# Altium project MTB Telemetry System.PrjPcb
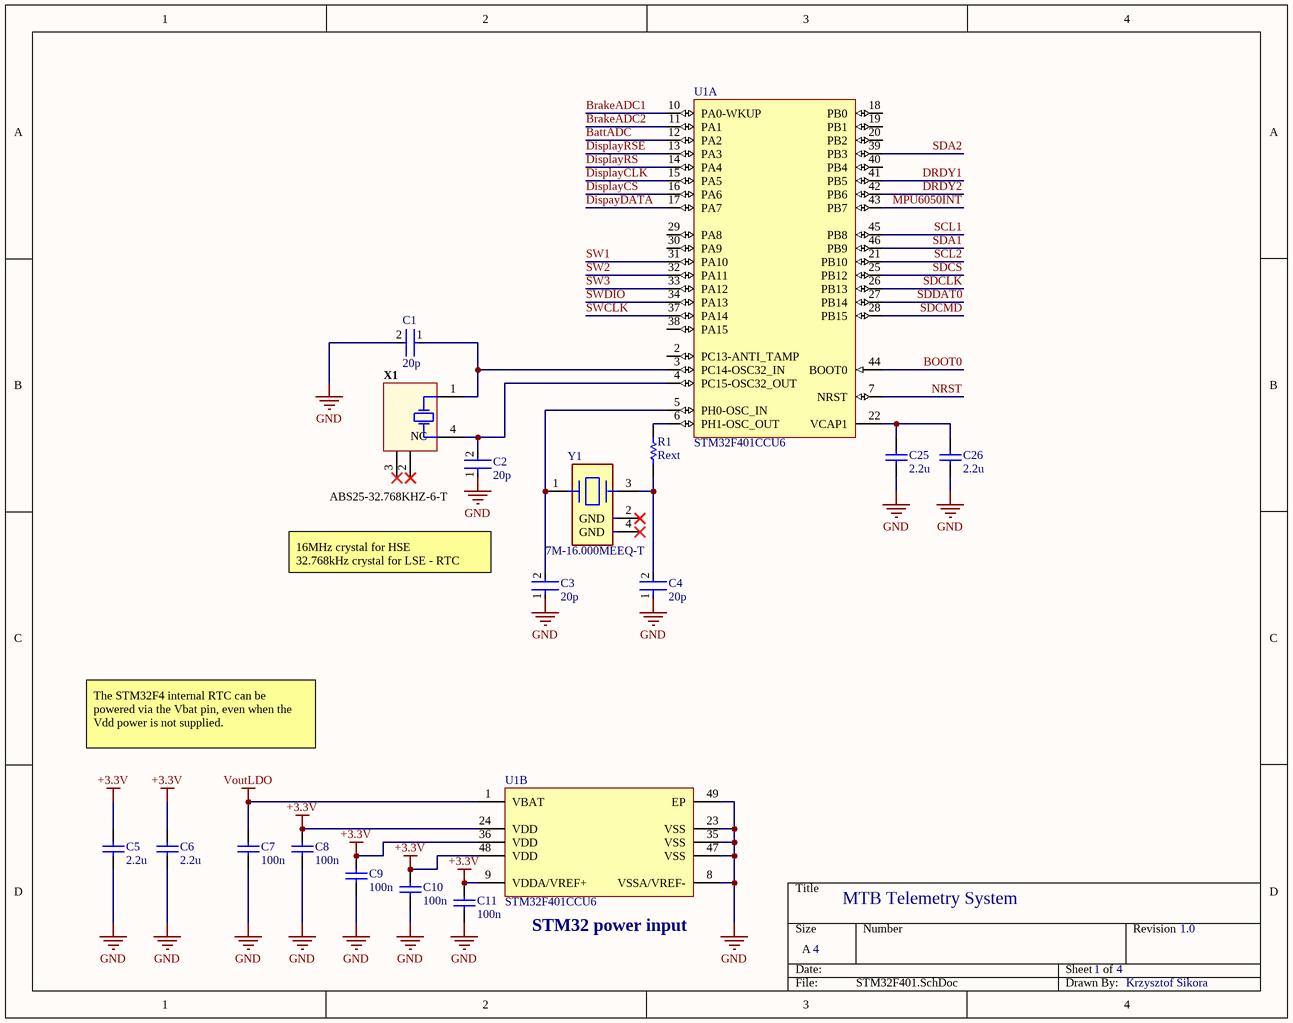
[diagram p0: STM32F401.SchDoc]
4 sheets, 66 parts. Net scope: global (net labels, ports and power ports of the same name join across sheets).
Board file: MTB_Telemetry_System_PCB.PcbDoc
Sheets:
  STM32F401.SchDoc
  Power supply.SchDoc
  Sensors.SchDoc
  Peripherals.SchDoc

## Sheet STM32F401.SchDoc
size A; SheetNumber: 1; SheetTotal: 4

### Parts
C1  20p  [FP-C0603C-CF-MFG]
C2  20p  [FP-C0603C-CF-MFG]
C3  20p  [FP-C0603C-CF-MFG]
C4  20p  [FP-C0603C-CF-MFG]
C5  2.2u  [CAPC2013X88X50LL20T25]
C6  2.2u  [CAPC2013X88X50LL20T25]
C7  100n  [CAPC2013X88X50LL20T25]
C8  100n  [CAPC2013X88X50LL20T25]
C9  100n  [CAPC2013X88X50LL20T25]
C10  100n  [CAPC2013X88X50LL20T25]
C11  100n  [CAPC2013X88X50LL20T25]
C25  2.2u  [CAPC2013X88X50LL20T25]
C26  2.2u  [CAPC2013X88X50LL20T25]
R1  Rext  [RESC1609X50X30NL8T20]
U1  STM32F401CCU6  [STM-UFQFPN48_N]  (parts A,B of 2)
X1  ABS25-32.768KHZ-6-T  [ABRA-ABS25-4_V]
Y1  7M-16.000MEEQ-T  [FP-7M-MFG]

### Nets
+3.3V: C5.2 C6.2 C8.2 C9.2 C10.2 C11.2 U1.9(VDDA/VREF+) U1.24(VDD) U1.36(VDD) U1.48(VDD)
GND: C1.2 C2.1 C3.1 C4.1 C5.1 C6.1 C7.1 C8.1 C9.1 C10.1 C11.1 C25.1 C26.1 U1.8(VSSA/VREF-) U1.23(VSS) U1.35(VSS) U1.47(VSS) U1.49(EP)
VoutLDO: C7.2 U1.1(VBAT)
BattADC: U1.12(PA2)
BOOT0: U1.44(BOOT0)
BrakeADC1: U1.10(PA0-WKUP)
BrakeADC2: U1.11(PA1)
DispayDATA: U1.17(PA7)
DisplayCLK: U1.15(PA5)
DisplayCS: U1.16(PA6)
DisplayRS: U1.14(PA4)
DisplayRSE: U1.13(PA3)
DRDY1: U1.41(PB5)
DRDY2: U1.42(PB6)
MPU6050INT: U1.43(PB7)
NRST: U1.7(NRST)
SCL1: U1.45(PB8)
SCL2: U1.21(PB10)
SDA1: U1.46(PB9)
SDA2: U1.39(PB3)
SDCLK: U1.26(PB13)
SDCMD: U1.28(PB15)
SDCS: U1.25(PB12)
SDDAT0: U1.27(PB14)
SW1: U1.31(PA10)
SW2: U1.32(PA11)
SW3: U1.33(PA12)
SWCLK: U1.37(PA14)
SWDIO: U1.34(PA13)
NetC1_1: C1.1 U1.3(PC14-OSC32_IN) X1.1(X1)
NetC2_2: C2.2 U1.4(PC15-OSC32_OUT) X1.4(X2)
NetC3_2: C3.2 U1.5(PH0-OSC_IN) Y1.1
NetC4_2: C4.2 R1.1 Y1.3
NetC25_2: C25.2 C26.2 U1.22(VCAP1)
NetR1_2: R1.2 U1.6(PH1-OSC_OUT)

Not connected (* = marked no-connect by the designer): U1 2(PC13-ANTI_TAMP) 18(PB0) 19(PB1) 20(PB2) 29(PA8) 30(PA9) 38(PA15) 40(PB4); X1 2(NC)* 3(NC)*; Y1 2(GND)* 4(GND)*

### Notes on the sheet
- 16MHz crystal for HSE
  32.768kHz crystal for LSE - RTC
- The STM32F4 internal RTC can be powered via the Vbat pin, even when the Vdd power is not supplied.
- MTB Telemetry System
- (near U1) STM32 power input
- 4
- 1
- 1.0
- Krzysztof Sikora

### Library data of the parts
C1-C4 = CMP-2006-03061-2: CAP CER 0.1UF 50V X7R 0603; Manufacturer: KEMET; Manufacturer Part Number: C0603C104K5RACTU; Tolerance: 0.1; Temperature Coefficient: 30ppm/°C; Material: Ceramic; Automotive Grade: Grade 1; Value: 0.10 μF; Temperature: -55°C to +125°C; RoHS: TRUE; Temperature Range High: +125°C; Lead Free: Yes; Octopart: https://octopart.com/c0603c104k5ractu-kemet-139244; Digikey Description: CAP CER 0.1UF 50V X7R 0603; Category: Cap; Package: C0603C-CF; ComponentLink2Description: Datasheet; Temperature Range Low: -55°C; Device Class L1: Passive Components; Voltage Rating: 50 V; Automotive: Yes; Device Class L3: Ceramic Capacitors; ComponentLink2URL: https://api.kemet.com/component-edge/download/datasheet/C0603C100J5GACAUTO.pdf; Capacitance: 0.10 μF; Device Class L2: Capacitors; Temperature Characteristic: X7R; Height: 0.87mm
C5-C11 C25 C26 = CMP-2007-00266-1: Manufacturer: Kemet; Part Number: C0805C103K5RACTU
R1 = CMP-1666-00005-4: Chip Resistor, 10 KOhm, +/- 1%, 100 mW, -55 to 155 degC, 0603 (1608 Metric), RoHS, Tape and Reel; Manufacturer: Vishay Semiconductor; Voltage Rating: 75 V; Max Operating Temperature: 155 degC; PackageDescription: 2-Pin Surface Mount Device, Body 1.575 x 0.85 mm; ComponentLink1Description: Manufacturer URL; RoHSCompliant: true; PackageReference: 0603; REACH SVHC: Unknown; Length: 1.55 mm; DatasheetVersion: 06/2012; Packaging: Tape and Reel; Min Operating Temperature: -55 degC; Mounting Technology: Surface Mount; ComponentLink2URL: https://datasheet.ciiva.com/11809/0900766b80d98afc-11809037.pdf; Height: 0.45 mm; ComponentLink2Description: Datasheet; Package Quantity: 5000; ComponentLink1URL: http://www.vishay.com/
U1 = CMP-0243-00119-2: ARM Cortex-M4 32-bit MCU+FPU, 105 DMIPS, 256 kB Flash, 64 kB Internal RAM, 36 I/Os, 48-pin UFQFPN, -40 to 85 degC, Tray; Manufacturer: STMicroelectronics; Supply Voltage(Vcc) max (V): 3.6; I/Os (High Current): 36; Internal RAM Size (kB): 64; Operating Frequency(F) (Processor speed) (MHz): 84; FLASH Size (Prog) (kB): 256; Supply Voltage(Vcc) min (V): 1.8; Packing: Tray; PackageReference: UFQFPN48; PackageVersion: Rev. 1, 04/2013; Core: ARM Cortex-M4; ComponentLink1Description: Manufacturer URL; ComponentLink3Description: Package Specification; PackageDescription: 48-Pin Ultra Thin Fine Pitch Quad Flat No-Lead, 7 x 7 x 0.6 mm Body, 0.5 mm Pitch, Exposed Pad; Mounting Technology: Surface Mount; ComponentLink2URL: http://www.st.com/st-web-ui/static/active/en/resource/technical/document/data_brief/DM00071938.pdf; DatasheetVersion: Rev. 1; ComponentLink2Description: Datasheet; ComponentLink1URL: http://www.st.com/web/en/home.html; PartNumber: STM32F401CCU6; ComponentLink3URL: http://www.st.com/st-web-ui/static/active/en/resource/technical/document/data_brief/DM00071938.pdf
X1 = CMP-2000-05036-1: Low Frequency Crystal, 32.768 KHz, 6 pF, +/- 20 ppm, -40 to 85 degC, 4-Pin SMD, RoHS, Tape and Reel; Manufacturer: Abracon; Tolerance: 20PPM; ESR: 50kOhms; Case Width: 3.8mm; Case Height: 2.5mm; Case Length: 8mm; Load Capacitance: 6pF; Operating Temperature Range: -40Cto+85C; Package Reference: ABS25; Factory Pack Quantity: 3000; Package Description: 4-Pin Surface Mount Device, Body 8 x 3.8 mm, Pitch 5.5 mm; Frequency: 32.768kHz; Termination Style: SMD/SMT; Manufacturer URL: http://www.abracon.com/; Type: LowFrequencyCrystal; Dimensions: 3.8mmWx8mmLx2.5mmH; Product Category: Crystals; Series: ABS25; RoHS: Details; Package / Case: 8mmx3.8mm; Datasheet Version: Jun-17; Brand: ABRACON; Datasheet URL: https://datasheet.ciiva.com/854/abs25-854528.pdf; Packaging: Reel; Mounting Style: SMD/SMT
Y1 = CMP-18717-000438-1: Crystal 16MHz, 10ppm, 10pF, 60Ω; ESR (Equivalent Series Resistance): 100R; Width: 2.5mm; REACH SVHC: No SVHC; Mount: Surface Mount; Package Quantity: 1; Depth: 2.5mm; Frequency Tolerance: 10ppm; Length: 3.2mm; Packaging: Tape and Reel; Termination: SMD/SMT; RoHS Compliant: Yes; Max Operating Temperature: 70°C; Min Operating Temperature: -10°C; Tolerance: 10ppm; Frequency Stability: 10ppm; Series: 7M; Height: 0.031inch; Number of Pins: 4; Load Capacitance: 10pF; Frequency: 16MHz; Case/Package: SMD/SMT

## Sheet Power supply.SchDoc
size A; SheetNumber: 2; SheetTotal: 4
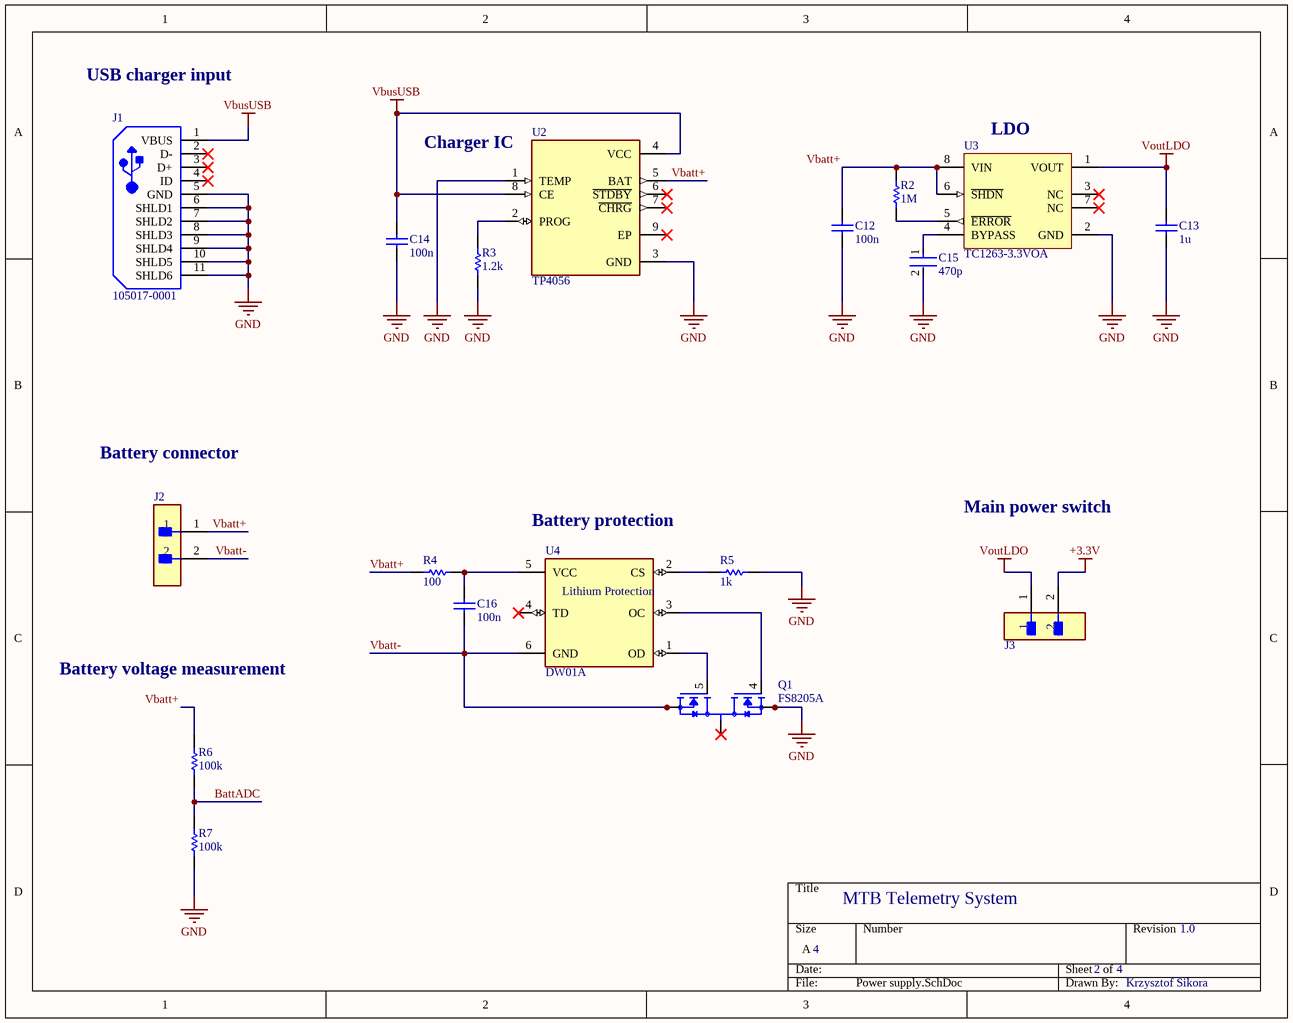
[diagram p1: Power supply.SchDoc]

### Parts
C12  100n  [CAPC2013X88X50LL20T25]
C13  1u  [CAPC2013X88X50LL20T25]
C14  100n  [CAPC2013X88X50LL20T25]
C15  470p  [FP-C0603C-CF-MFG]
C16  100n  [CAPC2013X88X50LL20T25]
J1  105017-0001  [USB-MICRO-B_V]
J2  B2B-XH-A(LF)(SN)  [FP-B2B-XH-A_LF_SN-MFG]  (value not drawn)
J3  B2B-XH-A(LF)(SN)  [FP-B2B-XH-A_LF_SN-MFG]  (value not drawn)
Q1  FS8205A  [SOP65P640X120-8N]
R2  1M  [RESC2013X60X35ML10T20]
R3  1.2k  [RESC2013X60X35ML10T20]
R4  100  [RESC2013X60X35ML10T20]
R5  1k  [RESC2013X60X35ML10T20]
R6  100k  [RESC2013X60X35ML10T20]
R7  100k  [RESC2013X60X35ML10T20]
U2  TP4056  [SOP127P600X175-9N]
U3  TC1263-3.3VOA  [SOIC-OA8_M]
U4  DW01A  [SOT23-6]

### Nets
+3.3V: J3.2
GND: C12.1 C13.1 C14.1 C15.2 J1.5(GND) J1.6(SHLD1) J1.7(SHLD2) J1.8(SHLD3) J1.9(SHLD4) J1.10(SHLD5) J1.11(SHLD6) Q1.2(S1) Q1.3(S1) R3.1 R5.1 R7.2 U2.1(TEMP) U2.3(GND) U3.2(GND)
VbusUSB: C14.2 J1.1(VBUS) U2.4(VCC) U2.8(CE)
VoutLDO: C13.2 J3.1 U3.1(VOUT)
BattADC: R6.2 R7.1
Vbatt+: C12.2 J2.1 R2.2 R4.2 R6.1 U2.5(BAT) U3.6(~{SHDN}) U3.8(VIN)
Vbatt-: C16.1 J2.2 Q1.6(S2) Q1.7(S2) U4.6(GND)
NetC15_1: C15.1 U3.4(BYPASS)
NetC16_2: C16.2 R4.1 U4.5(VCC)
NetQ1_1: Q1.1(D12) Q1.8(D12)
NetQ1_4: Q1.4(G1) U4.3(OC)
NetQ1_5: Q1.5(G2) U4.1(OD)
NetR2_1: R2.1 U3.5(~{ERROR})
NetR3_2: R3.2 U2.2(PROG)
NetR5_2: R5.2 U4.2(CS)

Not connected (* = marked no-connect by the designer): J1 2(D-)* 3(D+)* 4(ID)*; U2 6(~{STDBY})* 7(~{CHRG})* 9(EP)*; U3 3(NC)* 7(NC)*; U4 4(TD)*

### Notes on the sheet
- USB charger input
- (near U2) Charger IC
- (near U3) LDO
- Battery connector
- Battery protection
- Main power switch
- Battery voltage measurement
- MTB Telemetry System
- 4
- 2
- 1.0
- Krzysztof Sikora
- (in symbol DW01A) Lithium Protection

### Library data of the parts
C12-C14 C16 = CMP-2007-00266-1: as C5 on sheet STM32F401
C15 = CMP-2006-03061-2: as C1 on sheet STM32F401; Temperature: -55°C to +125°C; RoHS: TRUE; Temperature Range High: +125°C; Lead Free: Yes; Octopart: https://octopart.com/c0603c104k5ractu-kemet-139244; Digikey Description: CAP CER 0.1UF 50V X7R 0603; Category: Cap; Package: C0603C-CF; ComponentLink2Description: Datasheet; Temperature Range Low: -55°C; Device Class L1: Passive Components; Voltage Rating: 50 V; Automotive: Yes; Device Class L3: Ceramic Capacitors; ComponentLink2URL: https://api.kemet.com/component-edge/download/datasheet/C0603C100J5GACAUTO.pdf; Capacitance: 0.10 μF; Device Class L2: Capacitors; Temperature Characteristic: X7R; Height: 0.87mm
J1 = CMP-2000-05827-1: Micro-USB B Receptacle, Right Angle, Bottom Mount, Surface Mount, with Solder Tabs, -30 to 85 degC, 5-Pin USB, RoHS, Tape and Reel; Manufacturer: Molex; Featured Product: Micro-USBConnectorsUSBConnectors; Other Names: WM1399DKR; Package Version: Rev. F, 12/2012; Number of Contacts: 5; Connector Type: USB-microB; Catalog Drawings: 1050170001; 3D Model: 105017-0001.stp; Mating Products: WM17145-ND-CABLEMICROUSBBTOSTDA1.0MWM17147-ND-CABLEMICROUSBBTOSTDA2.0MWM17146-ND-CABLEMICROUSBBTOSTDA1.5M; PCN Assembly/Origin: ResinSupplier21/Oct/2015; Voltage - Max: 30V; Online Catalog: Molex-MicroUSB; Manufacturer URL: http://www.molex.com/; Package Description: 5-Leads USB, Micro B, Body 7.5 x 5 mm, Pitch 0.65 mm; Datasheet URL: http://www.molex.com/elqNow/elqRedir.htm?ref=http://www.molex.com/webdocs/datasheets/pdf/en-us/1050170001_IO_CONNECTORS.pdf; Ingress Protection: -; Datasheet Version: 03/2016; Mounting Type: BoardCutout,SurfaceMount,RightAngle; Circuits: 5; Standard Package: 1; Package Reference: MICRO-B; Package URL: http://www.molex.com/pdm_docs/sd/1050170001_sd.pdf; Category: Connectors,Interconnects; Series: -; RoHS Information: 1050170001CertofCompliance; Features: Shielded,SolderRetention; Family: USB,DVI,HDMIConnectors; Specifications: -; Gender: Receptacle; Packaging: Digi-Reel®; Mounting Technology: SurfaceMount
J2 J3 = CMP-2000-05888-3: CONN HEADER VERT 2POS 2.5MM; Current Rating: 3A; Voltage Rating: 250V; Number of Contacts: 2; Contact Resistance: 20mR; Wire/Cable Gauge: 22AWG; Insulation Resistance: 1GR; Connector Type: Male Pin; Packaging: Bulk; Contact Material: Brass; Lead Free: Lead Free; Orientation: Straight; Contact Plating: Tin; Max Current Rating: 3A; Termination: Solder; Fastening Type: Detent; Depth: 5.75mm; Housing Material: Polyamide; REACH SVHC: No SVHC; Series: XH; Voltage Rating (AC): 250V; Number of Positions: 2; Color: Natural; Contact Type: Male Pin; Max Voltage Rating (DC): 250V; Pitch: 2.5mm; Lead Pitch: 2.5mm; Mount: Through Hole; Max Operating Temperature: 85°C; Length: 7.4mm; Max Voltage Rating (AC): 250V; Min Operating Temperature: -25°C; Number of Rows: 1; Housing Color: White
Q1 = FS8205A: N/A; MF: Fortune Semiconductor; MP: FS8205A; Value: *; Availability: Not in stock; Package: Package; Price: None; SnapEDA_Link: https://www.snapeda.com/parts/FS8205A/Fortune+Semiconductor/view-part/?ref=snap; Check_prices: https://www.snapeda.com/parts/FS8205A/Fortune+Semiconductor/view-part/?ref=eda
R2-R7 = CMP-2100-03673-1: Chip Resistor, 0 Ohm, Jumper, +/- 5%, 0.125 W, -55 to 155 degC, 0805 (2012 Metric), RoHS, Tape and Reel; Manufacturer: Yageo; Power Rating: 125mW; Resistance: 0mOhm; Voltage Rating (DC): 150V; Temperature Coefficient: 200ppm/degreesC; Height: 0.5mm; Depth: 1.25mm; Case Code (Imperial): 0805; Lead Free: LeadFree; Military Standard: Not; Package Description: 2-Pin Surface Mounted Device, Body 2 x 1.25 mm; Case Code (Metric): 2012; Composition: ThickFilm; Voltage Rating: 150V; Manufacturer URL: http://www.yageo.com/; Packaging: TapeandReel; Package Reference: 0805; REACH SVHC: Unknown; Tolerance: 5%; Case/Package: 0805; Max Operating Temperature: 155degC; Number of Pins: 2; Min Operating Temperature: -55degC; RoHSCompliant: true; Length: 2mm; Datasheet URL: http://www.yageo.com/NewPortal/yageodocoutput?fileName=/pdf/R-Chip/PYu-RC_Group_51_RoHS_L_5.pdf; Termination: SMD/SMT; Radiation Hardening: No; Width: 1.25mm; Contact Plating: Tin; Datasheet Version: Rev. 5, 10/2016
U2 = TP4056: Complete single cell Li-Ion battery with a constant current / constant voltage linear charger; MF: NanJing Top Power ASIC Corp.; Check_prices: https://www.snapeda.com/parts/TP4056/NanJing+Top+Power+ASIC+Corp./view-part/?ref=eda; SnapEDA_Link: https://www.snapeda.com/parts/TP4056/NanJing+Top+Power+ASIC+Corp./view-part/?ref=snap; Price: None; Availability: Not in stock; Package: Package; MP: TP4056; Value: *
U3 = CMP-0136-00199-1: 500mA Fixed Output, CMOS LDO with Shutdown, 8-Pin SOIC 150mil, Extended Temperature; PackageDescription: 8-Lead Plastic Small Outline (OA) - Narrow, 3.90mm Body [SOIC]; PackageVersion: revBB, Aug-2009; DatasheetVersion: revC, Jan-2005; PackageReference: SOIC-OA8; Code_IPC: SOIC127P600-8
U4 = DW01A: One Cell Lithium-ion/Polymer Battery Protection IC; MF: Fortune Semiconductor; SnapEDA_Link: https://www.snapeda.com/parts/DW01A/Fortune+Semiconductor/view-part/?ref=snap; Package: SOT-23-6 Fortune Semiconductor; Value: *; MP: DW01A; Check_prices: https://www.snapeda.com/parts/DW01A/Fortune+Semiconductor/view-part/?ref=eda

## Sheet Sensors.SchDoc
size A; SheetNumber: 3; SheetTotal: 4
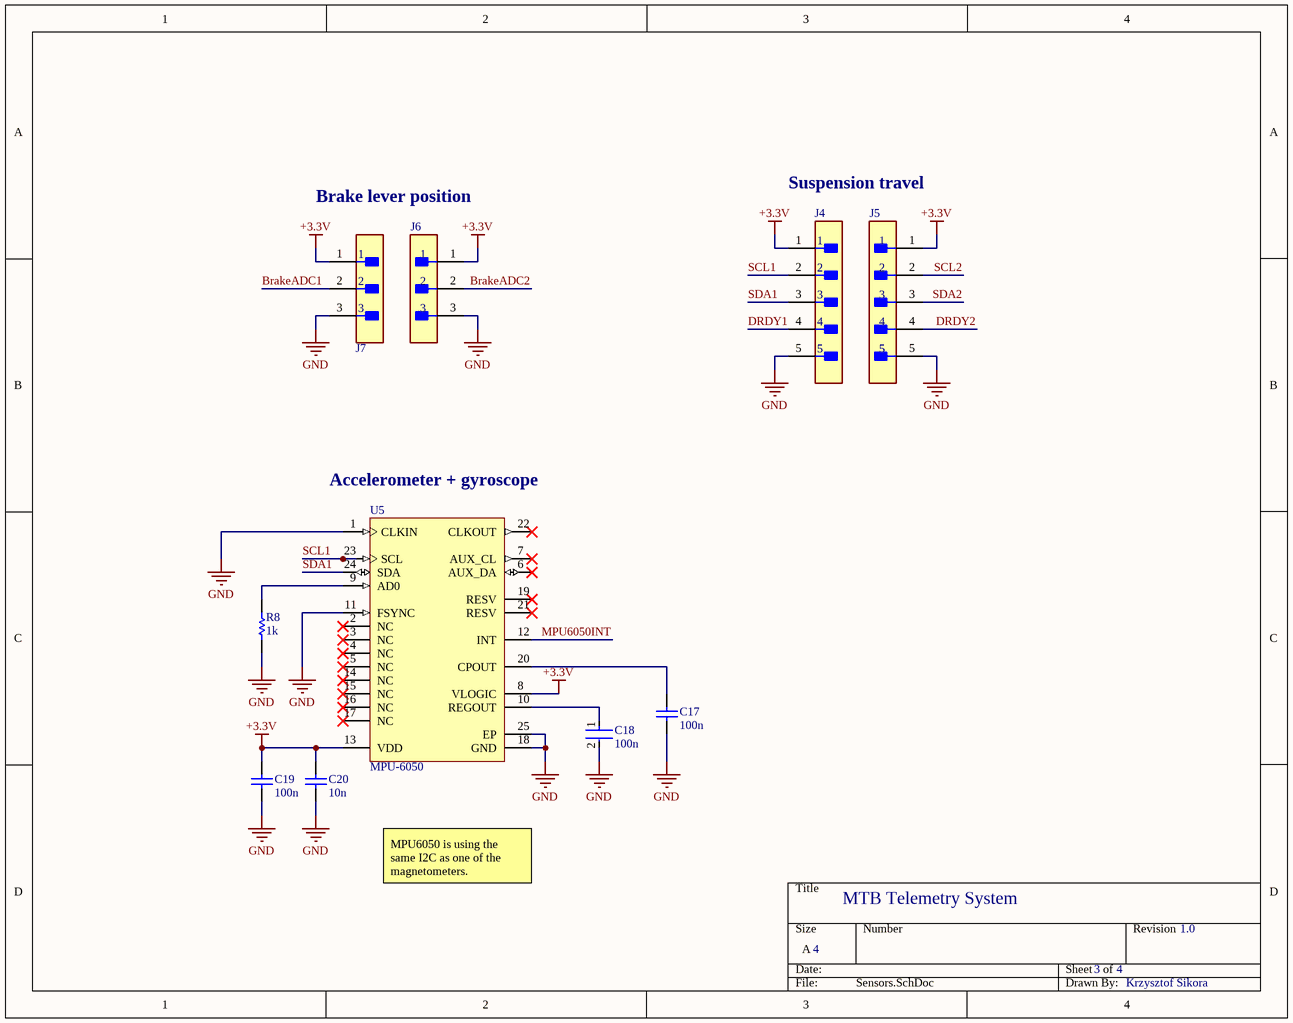
[diagram p2: Sensors.SchDoc]

### Parts
C17  100n  [CAPC2013X88X50LL20T25]
C18  100n  [FP-C0603C-CF-MFG]
C19  100n  [CAPC2013X88X50LL20T25]
C20  10n  [CAPC2013X88X50LL20T25]
J4  B5B-XH-AM(LF)(SN)  [FP-B5B-XH-AM_LF_SN-MFG]  (value not drawn)
J5  B5B-XH-AM(LF)(SN)  [FP-B5B-XH-AM_LF_SN-MFG]  (value not drawn)
J6  B3B-XH-A(LF)(SN)  [FP-B3B-XH-A_LF_SN-MFG]  (value not drawn)
J7  B3B-XH-A(LF)(SN)  [FP-B3B-XH-A_LF_SN-MFG]  (value not drawn)
R8  1k  [RESC2013X60X35ML10T20]
U5  MPU-6050  [IS-QFN-24_V]

### Nets
+3.3V: C19.2 C20.2 J4.1 J5.1 J6.1 J7.1 U5.8(VLOGIC) U5.13(VDD)
GND: C17.1 C18.2 C19.1 C20.1 J4.5 J5.5 J6.3 J7.3 R8.1 U5.1(CLKIN) U5.11(FSYNC) U5.18(GND) U5.25(EP)
BrakeADC1: J7.2
BrakeADC2: J6.2
DRDY1: J4.4
DRDY2: J5.4
MPU6050INT: U5.12(INT)
SCL1: J4.2 U5.23(SCL)
SCL2: J5.2
SDA1: J4.3 U5.24(SDA)
SDA2: J5.3
NetC17_2: C17.2 U5.20(CPOUT)
NetC18_1: C18.1 U5.10(REGOUT)
NetR8_2: R8.2 U5.9(AD0)

Not connected (* = marked no-connect by the designer): U5 2(NC)* 3(NC)* 4(NC)* 5(NC)* 6(AUX_DA)* 7(AUX_CL)* 14(NC)* 15(NC)* 16(NC)* 17(NC)* 19(RESV)* 21(RESV)* 22(CLKOUT)*

### Notes on the sheet
- Brake lever position
- Suspension travel
- (near U5) Accelerometer + gyroscope
- MPU6050 is using the same I2C as one of the magnetometers.
- MTB Telemetry System
- 4
- 3
- 1.0
- Krzysztof Sikora

### Library data of the parts
C17 C19 C20 = CMP-2007-00266-1: as C5 on sheet STM32F401
C18 = CMP-2006-03061-2: as C1 on sheet STM32F401; Temperature: -55°C to +125°C; RoHS: TRUE; Temperature Range High: +125°C; Lead Free: Yes; Octopart: https://octopart.com/c0603c104k5ractu-kemet-139244; Digikey Description: CAP CER 0.1UF 50V X7R 0603; Category: Cap; Package: C0603C-CF; ComponentLink2Description: Datasheet; Temperature Range Low: -55°C; Device Class L1: Passive Components; Voltage Rating: 50 V; Automotive: Yes; Device Class L3: Ceramic Capacitors; ComponentLink2URL: https://api.kemet.com/component-edge/download/datasheet/C0603C100J5GACAUTO.pdf; Capacitance: 0.10 μF; Device Class L2: Capacitors; Temperature Characteristic: X7R; Height: 0.87mm
J4 J5 = CMP-17439-000304-1: CONN HEADER VERT 5POS 2.5MM; Mated Stacking Heights: 9.8mm; Voltage Rating: 250V; Max Current Rating: 3A; Number of Positions: 5; Contact Resistance: 20mR; Depth: 5.75mm; Connector Type: Header; Color: Green; Insulation Material: Nylon; Contact Plating: Copper; Length: 14.9mm; Fastening Type: Detent; Contact Material: Brass; Number of Rows: 1; Contact Type: Male Pin; Housing Material: Polyamide; Housing Color: White; Lead Free: Lead Free; Max Voltage Rating (AC): 250V; Mount: Through Hole; Contact Shape: Square; Min Operating Temperature: -25°C; Packaging: Bulk; Orientation: Straight; Insulation Color: Natural; Series: XH; Flammability Rating: UL94 V-0; Contact Finish - Mating: TIN; Max Operating Temperature: 85°C; Termination: Solder; Pitch: 2.5mm
J6 J7 = CMP-17439-000014-3: CONN HEADER VERT 3POS 2.5MM; Max Voltage Rating (DC): 250V; Number of Positions: 3; Current Rating: 3A; Gender: Male; Wire/Cable Gauge: 22AWG; Contact Resistance: 20mR; Insulation Resistance: 1GR; Insulation Material: Nylon; Contact Plating: Tin; Depth: 5.75mm; Contact Type: Male Pin; Max Operating Temperature: 85°C; Insulation Color: Natural; Voltage Rating (AC): 250V; Color: Natural; Connector Type: Header; Orientation: Straight; Fastening Type: Detent; Housing Color: White; Min Operating Temperature: -25°C; Termination: Solder; Voltage Rating: 250V; Series: XH; Pitch: 2.5mm; Contact Shape: Square; Number of Rows: 1; Lead Free: Lead Free; Packaging: Bulk; Mount: Through Hole; Flammability Rating: UL94 V-0; Max Voltage Rating (AC): 250V; REACH SVHC: No SVHC; Housing Material: Polyamide; Contact Material: Brass; Lead Pitch: 2.5mm; Contact Finish - Mating: TIN; Length: 9.9mm; Max Current Rating: 3A; Number of Contacts: 3
R8 = CMP-2100-03673-1: as R2 on sheet Power supply; Height: 0.5mm; Depth: 1.25mm; Case Code (Imperial): 0805; Lead Free: LeadFree; Military Standard: Not; Package Description: 2-Pin Surface Mounted Device, Body 2 x 1.25 mm; Case Code (Metric): 2012; Composition: ThickFilm; Voltage Rating: 150V; Manufacturer URL: http://www.yageo.com/; Packaging: TapeandReel; Package Reference: 0805; REACH SVHC: Unknown; Tolerance: 5%; Case/Package: 0805; Max Operating Temperature: 155degC; Number of Pins: 2; Min Operating Temperature: -55degC; RoHSCompliant: true; Length: 2mm; Datasheet URL: http://www.yageo.com/NewPortal/yageodocoutput?fileName=/pdf/R-Chip/PYu-RC_Group_51_RoHS_L_5.pdf; Termination: SMD/SMT; Radiation Hardening: No; Width: 1.25mm; Contact Plating: Tin; Datasheet Version: Rev. 5, 10/2016
U5 = CMP-1753-00002-2: 3-Axis Gyroscope, Accelerometer and a Digital Motion Processor(TM) (DMP), 2.375 to 3.46 V, -40 to 85 degC, 24-Pin QFN, RoHS, Tape and Reel; Manufacturer: InvenSense; Featured Product: MPU-60506-Axis,IntegratedI²CSolution; Other Names: 1428-1007-2 / MPU6050; Sensor Type: MotionTracking; Online Catalog: MPU-6000™Series; Unit PriceUSD: Digital; Datasheet Version: Rev. 3.3, 05/2012; Category: Sensors,Transducers; Datasheet URL: http://datasheet.octopart.com/MPU-6050-InvenSense-datasheet-14421344.pdf; Family: Multifunction; Standard Package: 5,000; Manufacturer URL: http://www.invensense.com/; Output Type: Digital; Dynamic Catalog: MPU-6000™Series

## Sheet Peripherals.SchDoc
size A; SheetNumber: 4; SheetTotal: 4
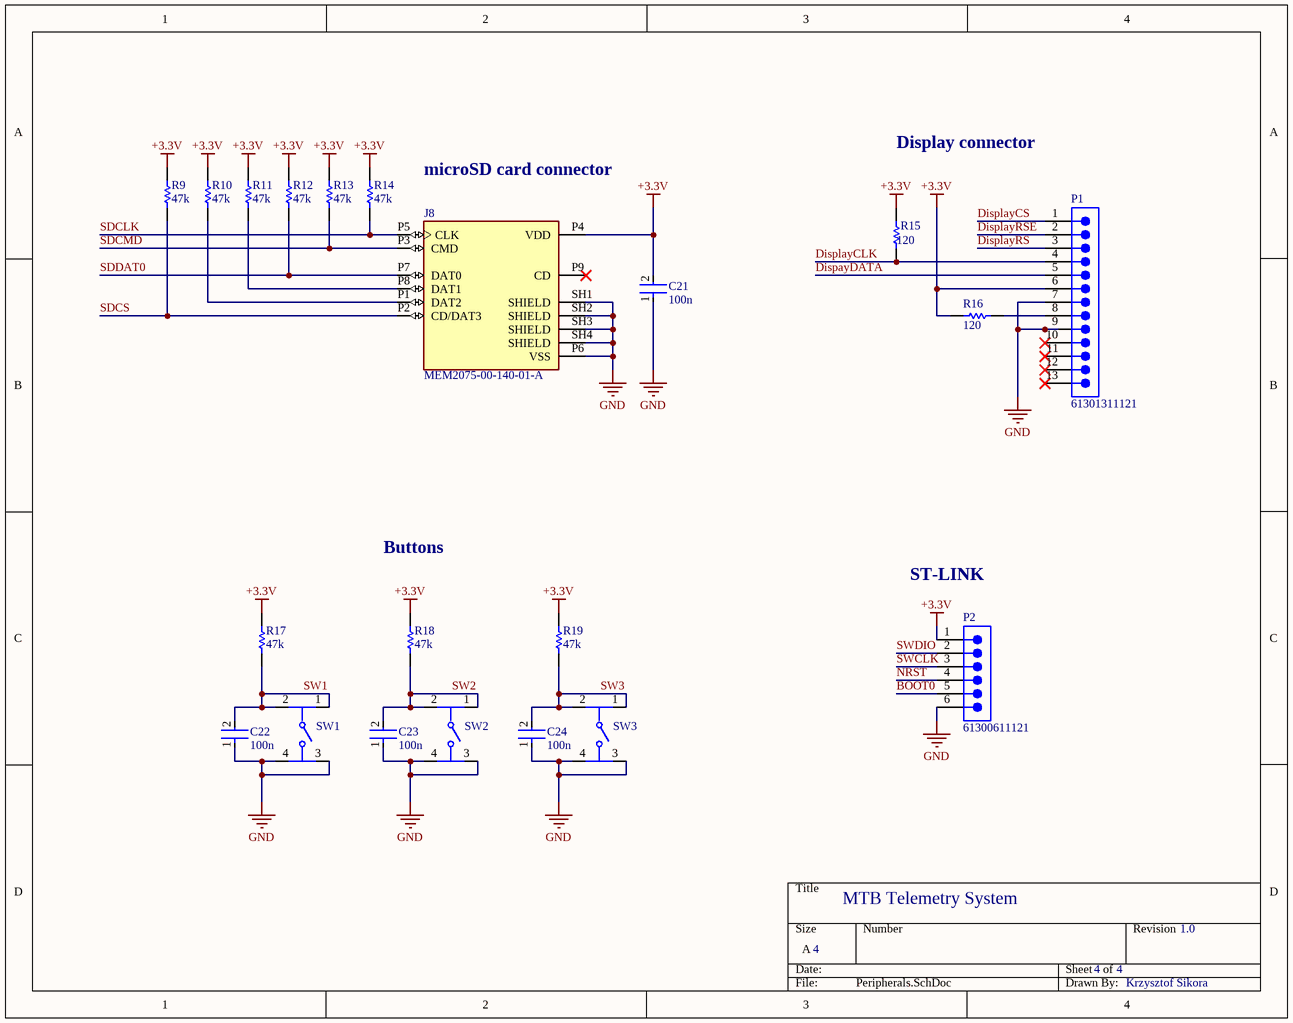
[diagram p3: Peripherals.SchDoc]

### Parts
C21  100n  [FP-C0603C-CF-MFG]
C22  100n  [FP-C0603C-CF-MFG]
C23  100n  [FP-C0603C-CF-MFG]
C24  100n  [FP-C0603C-CF-MFG]
J8  MEM2075-00-140-01-A  [GCT_MEM2075-00-140-01-A]
P1  61301311121  [61301311121]
P2  61300611121  [61300611121]
R9  47k  [RESC2013X60X35ML10T20]
R10  47k  [RESC2013X60X35ML10T20]
R11  47k  [RESC2013X60X35ML10T20]
R12  47k  [RESC2013X60X35ML10T20]
R13  47k  [RESC2013X60X35ML10T20]
R14  47k  [RESC2013X60X35ML10T20]
R15  120  [RESC2013X60X35ML10T20]
R16  120  [RESC2013X60X35ML10T20]
R17  47k  [RESC2013X60X35ML10T20]
R18  47k  [RESC2013X60X35ML10T20]
R19  47k  [RESC2013X60X35ML10T20]
SW1  1-1825910-0  [FP-1-1825910-0-MFG]  (value not drawn)
SW2  1-1825910-0  [FP-1-1825910-0-MFG]  (value not drawn)
SW3  1-1825910-0  [FP-1-1825910-0-MFG]  (value not drawn)

### Nets
+3.3V: C21.2 J8.P4(VDD) P1.6 P2.1 R9.2 R10.2 R11.2 R12.2 R13.2 R14.2 R15.1 R16.2 R17.2 R18.2 R19.2
GND: C21.1 C22.1 C23.1 C24.1 J8.P6(VSS) J8.SH1(SHIELD) J8.SH2(SHIELD) J8.SH3(SHIELD) J8.SH4(SHIELD) P1.7 P1.9 P2.6 SW1.3 SW1.4 SW2.3 SW2.4 SW3.3 SW3.4
BOOT0: P2.5
DispayDATA: P1.5
DisplayCLK: P1.4 R15.2
DisplayCS: P1.1
DisplayRS: P1.3
DisplayRSE: P1.2
NRST: P2.4
SDCLK: J8.P5(CLK) R14.1
SDCMD: J8.P3(CMD) R13.1
SDCS: J8.P2(CD/DAT3) R9.1
SDDAT0: J8.P7(DAT0) R12.1
SW1: C22.2 R17.1 SW1.1 SW1.2
SW2: C23.2 R18.1 SW2.1 SW2.2
SW3: C24.2 R19.1 SW3.1 SW3.2
SWCLK: P2.3
SWDIO: P2.2
NetJ8_P1: J8.P1(DAT2) R10.1
NetJ8_P8: J8.P8(DAT1) R11.1
NetP1_8: P1.8 R16.1

Not connected (* = marked no-connect by the designer): J8 P9(CD)*; P1 10* 11* 12* 13*

### Notes on the sheet
- Display connector
- microSD card connector
- Buttons
- ST-LINK
- MTB Telemetry System
- 4
- 1.0
- Krzysztof Sikora

### Library data of the parts
C21-C24 = CMP-2006-03061-2: as C1 on sheet STM32F401; Temperature: -55°C to +125°C; RoHS: TRUE; Temperature Range High: +125°C; Lead Free: Yes; Octopart: https://octopart.com/c0603c104k5ractu-kemet-139244; Digikey Description: CAP CER 0.1UF 50V X7R 0603; Category: Cap; Package: C0603C-CF; ComponentLink2Description: Datasheet; Temperature Range Low: -55°C; Device Class L1: Passive Components; Voltage Rating: 50 V; Automotive: Yes; Device Class L3: Ceramic Capacitors; ComponentLink2URL: https://api.kemet.com/component-edge/download/datasheet/C0603C100J5GACAUTO.pdf; Capacitance: 0.10 μF; Device Class L2: Capacitors; Temperature Characteristic: X7R; Height: 0.87mm
J8 = MEM2075-00-140-01-A: Micro SD Memory Card Connector, 1.4mm Profile SMT, Push-Push, with Normally open Switch; MP: MEM2075-00-140-01-A; Value: *; Price: None; Package: None; Availability: Unavailable
P1 = CMP-1502-01089-2: NexarPartId: 32855541; Current Rating: 3A; Gender: Male; Pitch: 2.54mm; Contact Resistance: 20mΩ; Connector Type: Male Pin; Operating Supply Voltage: 250V; Number of Positions: 13; Contact Material: Copper; Number of Rows: 1; Lead Pitch: 2.54mm; Termination: Solder; Packaging: Bulk; Color: Black; Mount: Through Hole; Orientation: Vertical; RoHS: Compliant; Number of Pins: 13; Lead Free: Lead Free; Contact Mating Length: 5.9944mm; Contact Plating: Gold; REACH SVHC: Unknown; Number of Contacts: 13
P2 = CMP-1502-01070-2: NexarPartId: 20084590; Operating Supply Voltage: 250V; Current Rating: 3A; Number of Contacts: 6; Gender: Male; Connector Type: Male Pin; Pitch: 2.54mm; Contact Resistance: 20mΩ; Lead Free: Lead Free; REACH SVHC: Unknown; Number of Rows: 1; Color: Black; Min Operating Temperature: -40°C; Contact Material: Copper; Lead Pitch: 2.54mm; Contact Plating: Gold; Number of Pins: 6; Height: 8.89mm; Orientation: Vertical; Termination: Through Hole; Mount: Through Hole; RoHS: Compliant; Contact Gender: Male; Contact Mating Length: 5.9944mm; Voltage Rating: 250V; Number of Positions: 6; Housing Material: PBT; Packaging: Bulk; Max Operating Temperature: 105°C
R9-R19 = CMP-2100-03673-1: as R2 on sheet Power supply; Height: 0.5mm; Depth: 1.25mm; Case Code (Imperial): 0805; Lead Free: LeadFree; Military Standard: Not; Package Description: 2-Pin Surface Mounted Device, Body 2 x 1.25 mm; Case Code (Metric): 2012; Composition: ThickFilm; Voltage Rating: 150V; Manufacturer URL: http://www.yageo.com/; Packaging: TapeandReel; Package Reference: 0805; REACH SVHC: Unknown; Tolerance: 5%; Case/Package: 0805; Max Operating Temperature: 155degC; Number of Pins: 2; Min Operating Temperature: -55degC; RoHSCompliant: true; Length: 2mm; Datasheet URL: http://www.yageo.com/NewPortal/yageodocoutput?fileName=/pdf/R-Chip/PYu-RC_Group_51_RoHS_L_5.pdf; Termination: SMD/SMT; Radiation Hardening: No; Width: 1.25mm; Contact Plating: Tin; Datasheet Version: Rev. 5, 10/2016
SW1-SW3 = CMP-03407-000018-1: SWITCH TACTILE SPST-NO 0.05A 24V; Switch Function: Off-Mom; Mechanical Life: 100000Cycles; Actuator Material: Nylon; Actuator Color: Blue; Contact Current Rating: 50mA; Illumination Type: Non-Illuminated; Throw Configuration: SPST; Actuator Length: 3.4mm; Operating Force: 1.56N; Actuator Type: Standard; Contact Resistance: 100mR; Switch Travel: 0.25mm; Depth: 5.99mm; Contact Plating: Silver; Max Operating Temperature: 85°C; Electrical Life: 100000Cycles; Min Operating Temperature: -35°C; RoHS Compliant: Yes; Max Voltage Rating (DC): 24V; Mount: Through Hole; Packaging: Loose Piece; Length: 5.99mm; Series: FSMJ, Alcoswitch; Orientation: Straight; Contact Material: Brass; Radiation Hardening: No; Package Quantity: 750; Max Current Rating: 50mA; Termination: PC Pins; Type: Switch; Voltage Rating (DC): 24V

## Nets that join several sheets
+3.3V: STM32F401 (10 pins), Power supply (J3.2), Sensors (8 pins), Peripherals (15 pins)
GND: STM32F401 (18 pins), Power supply (19 pins), Sensors (13 pins), Peripherals (18 pins)
VoutLDO: STM32F401 (C7.2 U1.1), Power supply (C13.2 J3.1 U3.1)
BattADC: STM32F401 (U1.12), Power supply (R6.2 R7.1)
BOOT0: STM32F401 (U1.44), Peripherals (P2.5)
BrakeADC1: STM32F401 (U1.10), Sensors (J7.2)
BrakeADC2: STM32F401 (U1.11), Sensors (J6.2)
DispayDATA: STM32F401 (U1.17), Peripherals (P1.5)
DisplayCLK: STM32F401 (U1.15), Peripherals (P1.4 R15.2)
DisplayCS: STM32F401 (U1.16), Peripherals (P1.1)
DisplayRS: STM32F401 (U1.14), Peripherals (P1.3)
DisplayRSE: STM32F401 (U1.13), Peripherals (P1.2)
DRDY1: STM32F401 (U1.41), Sensors (J4.4)
DRDY2: STM32F401 (U1.42), Sensors (J5.4)
MPU6050INT: STM32F401 (U1.43), Sensors (U5.12)
NRST: STM32F401 (U1.7), Peripherals (P2.4)
SCL1: STM32F401 (U1.45), Sensors (J4.2 U5.23)
SCL2: STM32F401 (U1.21), Sensors (J5.2)
SDA1: STM32F401 (U1.46), Sensors (J4.3 U5.24)
SDA2: STM32F401 (U1.39), Sensors (J5.3)
SDCLK: STM32F401 (U1.26), Peripherals (J8.P5 R14.1)
SDCMD: STM32F401 (U1.28), Peripherals (J8.P3 R13.1)
SDCS: STM32F401 (U1.25), Peripherals (J8.P2 R9.1)
SDDAT0: STM32F401 (U1.27), Peripherals (J8.P7 R12.1)
SW1: STM32F401 (U1.31), Peripherals (C22.2 R17.1 SW1.1 SW1.2)
SW2: STM32F401 (U1.32), Peripherals (C23.2 R18.1 SW2.1 SW2.2)
SW3: STM32F401 (U1.33), Peripherals (C24.2 R19.1 SW3.1 SW3.2)
SWCLK: STM32F401 (U1.37), Peripherals (P2.3)
SWDIO: STM32F401 (U1.34), Peripherals (P2.2)